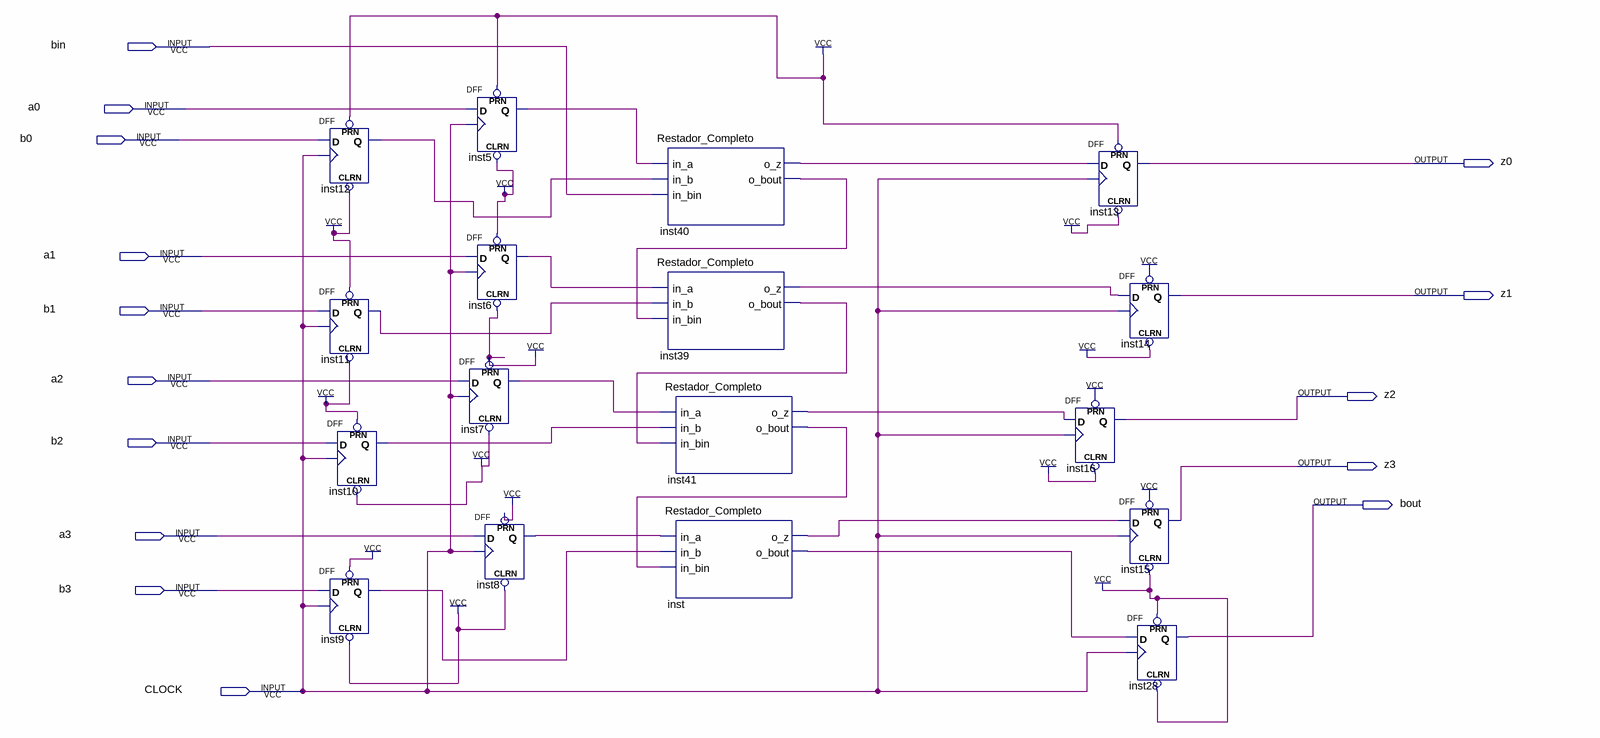
[diagram p0: schematic sheet]
// Quartus schematic Restador_Completo_4b.bdf as structural Verilog: 17 symbols, 15 pins
module Restador_Completo_4b (
  input  bin,
  input  a0,
  input  b0,
  input  a1,
  input  b1,
  input  a2,
  input  b2,
  input  a3,
  input  b3,
  input  CLOCK,
  output z0,
  output z1,
  output z2,
  output z3,
  output bout
);

  wire inst5_q, inst6_q, inst7_q, inst8_q, inst9_q, inst10_q, inst11_q, inst12_q, inst39_o_bout, inst39_o_z,
       inst40_o_bout, inst40_o_z, inst41_o_bout, inst41_o_z, inst_o_bout, inst_o_z;

  DFF inst12 (.CLRN(1'b1), .CLK(CLOCK), .D(b0), .PRN(1'b1), .Q(inst12_q));
  DFF inst11 (.CLRN(1'b1), .CLK(CLOCK), .D(b1), .PRN(1'b1), .Q(inst11_q));
  DFF inst10 (.CLRN(1'b1), .CLK(CLOCK), .D(b2), .PRN(1'b1), .Q(inst10_q));
  DFF inst9 (.CLRN(1'b1), .CLK(CLOCK), .D(b3), .PRN(1'b1), .Q(inst9_q));
  DFF inst5 (.CLRN(1'b1), .CLK(CLOCK), .D(a0), .PRN(1'b1), .Q(inst5_q));
  DFF inst6 (.CLRN(1'b1), .CLK(CLOCK), .D(a1), .PRN(1'b1), .Q(inst6_q));
  DFF inst7 (.CLRN(1'b1), .CLK(CLOCK), .D(a2), .PRN(1'b1), .Q(inst7_q));
  DFF inst8 (.CLRN(1'b1), .CLK(CLOCK), .D(a3), .PRN(1'b1), .Q(inst8_q));
  Restador_Completo inst40 (.in_a(inst5_q), .in_b(inst12_q), .in_bin(bin), .o_z(inst40_o_z), .o_bout(inst40_o_bout));
  Restador_Completo inst39 (
    .in_a(inst6_q), .in_b(inst11_q), .in_bin(inst40_o_bout), .o_z(inst39_o_z), .o_bout(inst39_o_bout));
  Restador_Completo inst41 (
    .in_a(inst7_q), .in_b(inst10_q), .in_bin(inst39_o_bout), .o_z(inst41_o_z), .o_bout(inst41_o_bout));
  Restador_Completo inst (.in_a(inst8_q), .in_b(inst9_q), .in_bin(inst41_o_bout), .o_z(inst_o_z), .o_bout(inst_o_bout));
  DFF inst13 (.CLRN(1'b1), .CLK(CLOCK), .D(inst40_o_z), .PRN(1'b1), .Q(z0));
  DFF inst16 (.CLRN(1'b1), .CLK(CLOCK), .D(inst41_o_z), .PRN(1'b1), .Q(z2));
  DFF inst14 (.CLRN(1'b1), .CLK(CLOCK), .D(inst39_o_z), .PRN(1'b1), .Q(z1));
  DFF inst15 (.CLRN(1'b1), .CLK(CLOCK), .D(inst_o_z), .PRN(1'b1), .Q(z3));
  DFF inst28 (.CLRN(1'b1), .CLK(CLOCK), .D(inst_o_bout), .PRN(1'b1), .Q(bout));
endmodule
